# Altium schematic sheet H_Bridge_AON6500.SchDoc
size A4
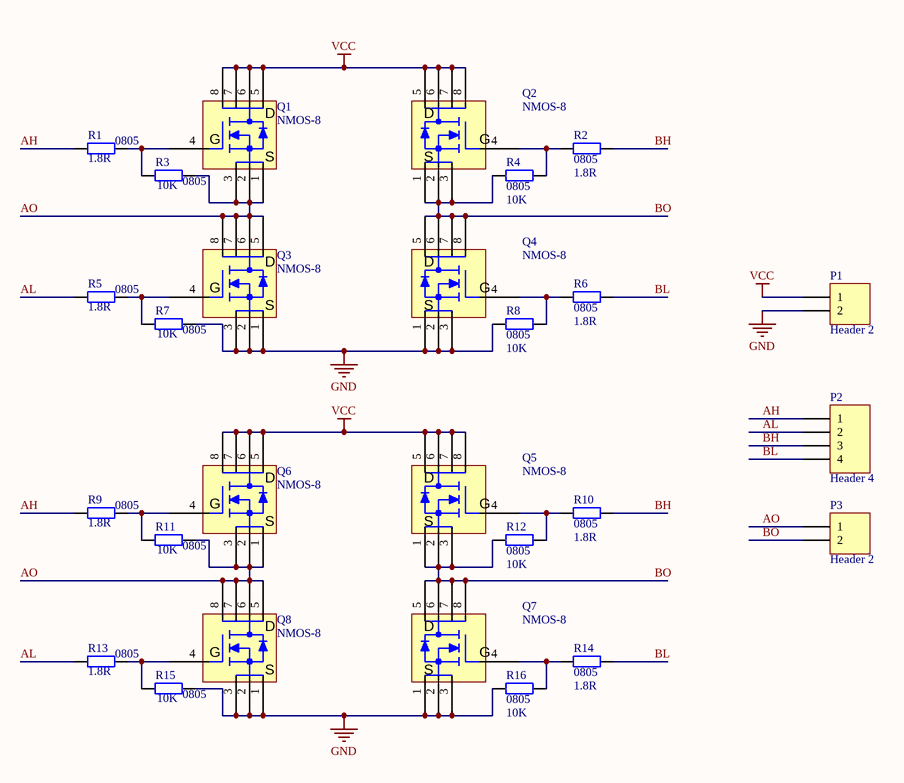
[diagram p0: H_Bridge_AON6500.SchDoc]

## Parts
P1  Header 2  [HDR2.54-LI-2P]
P2  Header 4  [HDR2.54-LI-4P]
P3  Header 2  [HDR2.54-LI-2P]
Q1  NMOS-8  [PSOP8]
Q2  NMOS-8  [PSOP8]
Q3  NMOS-8  [PSOP8]
Q4  NMOS-8  [PSOP8]
Q5  NMOS-8  [PSOP8]
Q6  NMOS-8  [PSOP8]
Q7  NMOS-8  [PSOP8]
Q8  NMOS-8  [PSOP8]
R1  0805  value 1.8R  [R 0805_L]
R2  0805  value 1.8R  [R 0805_L]
R3  0805  value 10K  [R 0805_L]
R4  0805  value 10K  [R 0805_L]
R5  0805  value 1.8R  [R 0805_L]
R6  0805  value 1.8R  [R 0805_L]
R7  0805  value 10K  [R 0805_L]
R8  0805  value 10K  [R 0805_L]
R9  0805  value 1.8R  [R 0805_L]
R10  0805  value 1.8R  [R 0805_L]
R11  0805  value 10K  [R 0805_L]
R12  0805  value 10K  [R 0805_L]
R13  0805  value 1.8R  [R 0805_L]
R14  0805  value 1.8R  [R 0805_L]
R15  0805  value 10K  [R 0805_L]
R16  0805  value 10K  [R 0805_L]

## Nets
GND: P1.2 Q3.1(S) Q3.2(S) Q3.3(S) Q4.1(S) Q4.2(S) Q4.3(S) Q7.1(S) Q7.2(S) Q7.3(S) Q8.1(S) Q8.2(S) Q8.3(S) R7.2 R8.2 R15.2 R16.2
VCC: P1.1 Q1.5 Q1.6 Q1.7 Q1.8 Q2.5 Q2.6 Q2.7 Q2.8 Q5.5 Q5.6 Q5.7 Q5.8 Q6.5 Q6.6 Q6.7 Q6.8
AH: P2.1 R1.1 R9.1
AL: P2.2 R5.1 R13.1
AO: P3.1 Q1.1(S) Q1.2(S) Q1.3(S) Q3.5 Q3.6 Q3.7 Q3.8 Q6.1(S) Q6.2(S) Q6.3(S) Q8.5 Q8.6 Q8.7 Q8.8 R3.2 R11.2
BH: P2.3 R2.1 R10.1
BL: P2.4 R6.1 R14.1
BO: P3.2 Q2.1(S) Q2.2(S) Q2.3(S) Q4.5 Q4.6 Q4.7 Q4.8 Q5.1(S) Q5.2(S) Q5.3(S) Q7.5 Q7.6 Q7.7 Q7.8 R4.2 R12.2
NetQ1_4: Q1.4(G) R1.2 R3.1
NetQ2_4: Q2.4(G) R2.2 R4.1
NetQ3_4: Q3.4(G) R5.2 R7.1
NetQ4_4: Q4.4(G) R6.2 R8.1
NetQ5_4: Q5.4(G) R10.2 R12.1
NetQ6_4: Q6.4(G) R9.2 R11.1
NetQ7_4: Q7.4(G) R14.2 R16.1
NetQ8_4: Q8.4(G) R13.2 R15.1

## Notes on the sheet
- (in symbol NMOS-8) D

## Library data of the parts
P1 P3 = Header 2: Header, 2-Pin; LatestRevisionDate: 17-Jul-2002; LatestRevisionNote: Re-released for DXP Platform.; Publisher: Altium Limited
P2 = Header 4: Header, 4-Pin; LatestRevisionDate: 17-Jul-2002; LatestRevisionNote: Re-released for DXP Platform.; Publisher: Altium Limited
R1-R16 = RES2: Resistor; Published: 8-Jun-2000; LatestRevisionDate: 17-Jul-2002; LatestRevisionNote: Re-released for DXP Platform.; PackageReference: AXIAL-0.3; Publisher: Altium Limited; PackageDescription: Axial Device, Thru-Hole; 2 Leads; 0.3 in Pin Spacing